# EAGLE design charger (EAGLE 6.4)
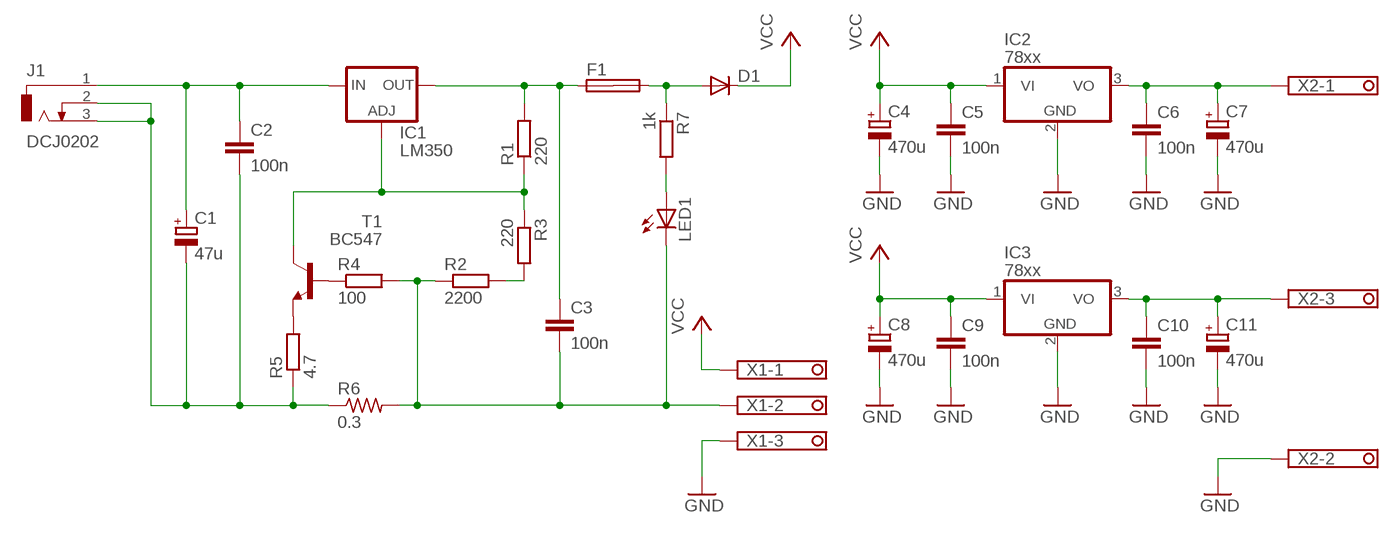
[diagram p0: schematic, sheet 1]

## Parts
C1  47u  CPOL-EUE2.5-7  [E2,5-7]
C2  100n  C-EU050-030X075  [C050-030X075]
C3  100n  C-EU050-030X075  [C050-030X075]
C4  470u  CPOL-EUE5-10.5  [E5-10,5]
C5  100n  C-EU050-030X075  [C050-030X075]
C6  100n  C-EU050-030X075  [C050-030X075]
C7  470u  CPOL-EUE5-10.5  [E5-10,5]
C8  470u  CPOL-EUE5-10.5  [E5-10,5]
C9  100n  C-EU050-030X075  [C050-030X075]
C10  100n  C-EU050-030X075  [C050-030X075]
C11  470u  CPOL-EUE5-10.5  [E5-10,5]
D1  SB320  [DO201-15]
F1  SHK20L  [SHK20L]
IC1  LM350  LM317TS  [317TS]
IC2  78xx  7805TV  [TO220V]
IC3  78xx  7805TV  [TO220V]
J1  DCJ0202  [DCJ0202]
LED1  LED5MM  [LED5MM]
R1  220  R-EU_0207/10  [0207/10]
R2  2200  R-EU_0207/10  [0207/10]
R3  220  R-EU_0207/10  [0207/10]
R4  100  R-EU_0207/10  [0207/10]
R5  4.7  R-EU_0207/10  [0207/10]
R6  0.3  R-US_0617/22  [0617/22]
R7  1k  R-EU_0207/10  [0207/10]
T1  BC547  [TO92]
X1  1751251  [1751251]
X2  1751251  [1751251]

## Nets
GND: C4.- C5.2 C6.2 C7.- C8.- C9.2 C10.2 C11.- IC2.2(GND) IC3.2(GND) X1.3 X2.2
N$1: C1.+ C2.1 IC1.3(IN) J1.1
N$2: C1.- C2.2 J1.2 J1.3 R5.1 R6.1
N$3: R4.1 T1.2(B)
N$4: R2.2 R3.2
N$5: IC1.1(ADJ) R1.1 R3.1 T1.3(C)
N$6: C10.1 C11.+ IC3.3(VO) X2.3
N$7: C3.2 LED1.K(C) R2.1 R4.2 R6.2 X1.2
N$8: R5.2 T1.1(E)
N$9: D1.A F1.2A R7.1
N$10: LED1.A R7.2
N$11: C6.1 C7.+ IC2.3(VO) X2.1
N$12: C3.1 F1.1A IC1.2(OUT) R1.2
VCC: C4.+ C5.1 C8.+ C9.1 D1.C IC2.1(VI) IC3.1(VI) X1.1
Unconnected: F1.1B F1.2B

## Library data of the parts
C1 C4 C7 C8 C11 = rcl:CPOL-EU: POLARIZED CAPACITOR, European symbol
C2 C3 C5 C6 C9 C10 = rcl:C-EU: CAPACITOR, European symbol
D1 = diode:SB320: DIODE barrier rectifier, 3 A (Fairchild)
F1 = fuse:SHK20L: FUSE HOLDER 5 x 20 mm, SH contact, SHH1 Schukat, E1073 Buerklin; OC_FARNELL: unknown; OC_NEWARK: unknown
IC1 = v-reg:LM317TS: VOLTAGE REGULATOR
IC2 IC3 = linear:78*: Positive VOLTAGE REGULATOR Source: http://cache.national.com/ds/LM/LM78L05.pdf http://www.fairchildsemi.com/ds/LM/LM7805.pdf
J1 = con-jack:DCJ0202: DC POWER JACK Source: DCJ0202.pdf; OC_FARNELL: unknown; OC_NEWARK: unknown
LED1 = led:LED: LED OSRAM: - CHIPLED LG R971, LG N971, LY N971, LG Q971, LY Q971, LO R971, LY R971 LH N974, LH R974 LS Q976, LO Q976, LY Q976 LO Q996 - Hyper CHIPLED LW Q18S LB Q993, LB Q99A, LB R99A - SideLED LS A670, LO A670, LY A670, LG A670, LP A670 LB A673, LV A673, LT A673, LW A673 LH A674 LY A675 LS A676, LA A676, LO A676, LY A676, LW A676 LS A679, LY A679, LG A679 - Hyper Micro SIDELED® LS Y876, LA Y876, LO Y876, LY Y876 LT Y87S - SmartLED LW L88C, LW L88S LB L89C, LB L89S, LG L890 LS L89K, LO L89K, LY L89K LS L896, LA L896, LO L896, LY L896 - TOPLED LS T670, LO T670, LY T670, LG T670, LP T670 LSG T670, LSP T670, LSY T670, LOP T670, LYG T670 LG T671, LOG T671, LSG T671 LB T673, LV T673, LT T673, LW T673 LH T674 LS T676, LA T676, LO T676, LY T676, LB T676, LH T676, LSB T676, LW T676 LB T67C, LV T67C, LT T67C, LS T67K, LO T67K, LY T67K, LW E67C LS E67B, LA E67B, LO E67B, LY E67B, LB E67C, LV E67C, LT E67C LW T67C LS T679, LY T679, LG T679 LS T770, LO T770, LY T770, LG T770, LP T770 LB T773, LV T773, LT T773, LW T773 LH T774 LS E675, LA E675, LY E675, LS T675 LS T776, LA T776, LO T776, LY T776, LB T776 LHGB T686 LT T68C, LB T68C - Hyper Mini TOPLED® LB M676 - Mini TOPLED Santana® LG M470 LS M47K, LO M47K, LY M47K Source: http://www.osram.convergy.de LUXEON: - LUMILED® LXK2-PW12-R00, LXK2-PW12-S00, LXK2-PW14-U00, LXK2-PW14-V00 LXK2-PM12-R00, LXK2-PM12-S00, LXK2-PM14-U00 LXK2-PE12-Q00, LXK2-PE12-R00, LXK2-PE12-S00, LXK2-PE14-T00, LXK2-PE14-U00 LXK2-PB12-K00, LXK2-PB12-L00, LXK2-PB12-M00, LXK2-PB14-N00, LXK2-PB14-P00, LXK2-PB14-Q00 LXK2-PR12-L00, LXK2-PR12-M00, LXK2-PR14-Q00, LXK2-PR14-R00 LXK2-PD12-Q00, LXK2-PD12-R00, LXK2-PD12-S00 LXK2-PH12-R00, LXK2-PH12-S00 LXK2-PL12-P00, LXK2-PL12-Q00, LXK2-PL12-R00 Source: www.luxeon.com KINGBRIGHT: KA-3528ASYC Source: www.kingbright.com
R1-R5 R7 = rcl:R-EU_: RESISTOR, European symbol
R6 = rcl:R-US_: RESISTOR, American symbol
T1 = transistor:BC547: NPN TRANSISTOR
X1 X2 = con-phoenix-350:1751251: MKDS 1/ 3-3,5 Printklemme Nennstrom: 10 A Bemessungsspannung: 160 V Raster: 3,5 mm Polzahl: 3 Montageart: Löten Anschlussart: Schraubanschluss Anschlussrichtung vom Leiter zur Platine: 0° Source: http://eshop.phoenixcontact.com .. 1751251.pdf; OC_FARNELL: unknown; OC_NEWARK: unknown

## Board
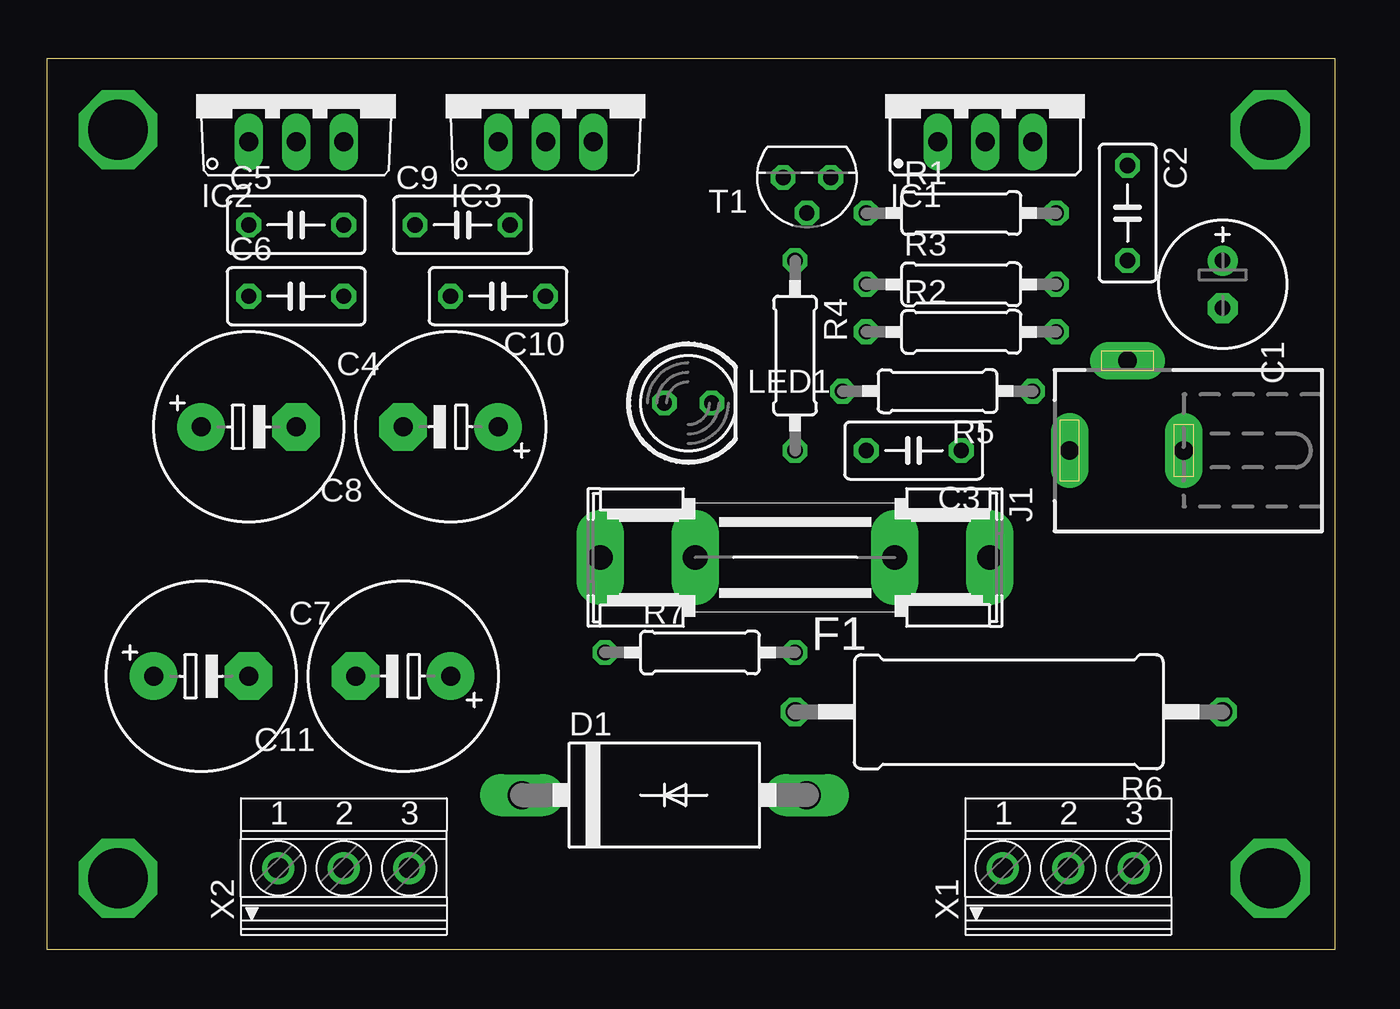
[diagram p1: board, top side]
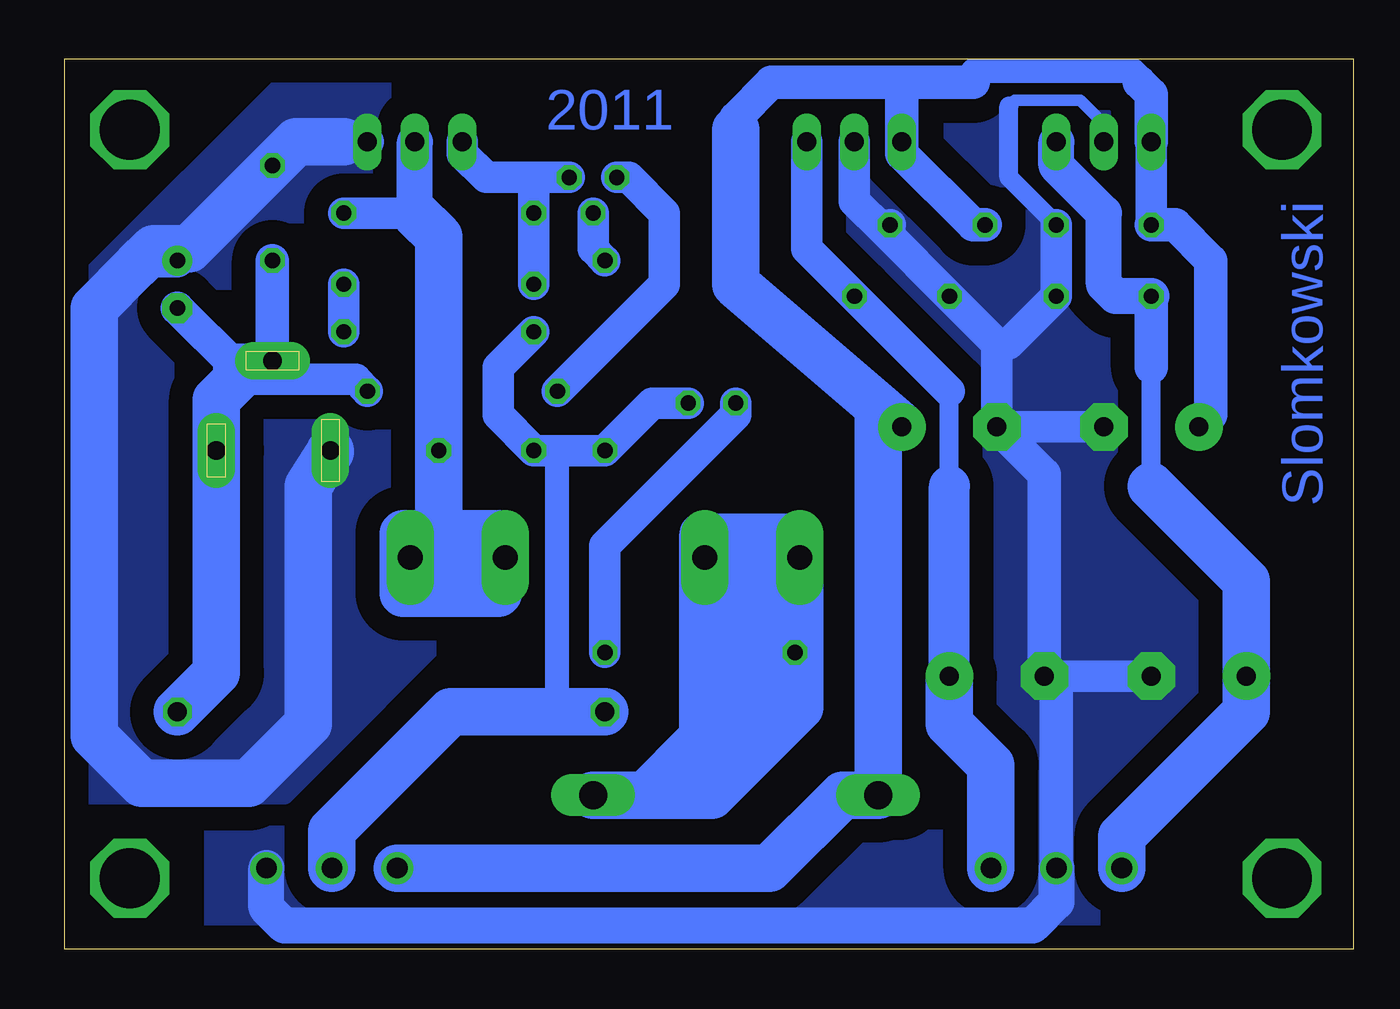
[diagram p2: board, bottom side, seen from below]

Size 68.89 x 47.62 mm. Coordinates in mm from the lower left corner, seen from the top.
Outline: 0,0 68.89,0 68.89,47.62 0,47.62 0,0
Copper layers (1*16): Top 0.035mm / dielectric 1.5mm / Bottom 0.035mm
Design rules "default": minimum track width 10mil, minimum drill 24mil, track to track 8mil, track to pad 8mil, pad to pad 8mil, via to via 8mil, smd to smd 8mil, copper to edge 40mil, drill to drill 8mil, minimum pad ring 10mil, minimum via ring 8mil, stop-mask expansion 4mil, vias tented up to drill 0mil, thermal gap 10mil

### Footprints (pad centres in the part's own frame; a part is rotated, then mirrored left to right if it is on the bottom)
E2,5-7 = drill 0.813 pad 1.6: + -1.27,0 | drill 0.813 pad 1.6 octagon: - 1.27,0
C050-030X075 = drill 0.813 octagon: 1 -2.54,0; 2 2.54,0
E5-10,5 = drill 1.016 pad 2.54: + -2.54,0 | drill 1.016 pad 2.54 octagon: - 2.54,0
DO201-15 = drill 1.499 long: A 7.62,0; C -7.62,0
SHK20L = drill 1.321 pad 2.54 long: 1A -10.414,0; 1B -5.334,0; 2A 10.414,0; 2B 5.334,0
317TS = drill 1.016 long: 1 -2.54,-2.54; 2 0,-2.54; 3 2.54,-2.54
TO220V = drill 1.016 long: 1 -2.54,-2.54; 2 0,-2.54; 3 2.54,-2.54
DCJ0202 = drill 1 pad 2 long: 1 0,3.1; 2 4.8,0; 3 0,-3
LED5MM = drill 0.813 octagon: A -1.27,0; K 1.27,0
0207/10 = drill 0.813 octagon: 1 -5.08,0; 2 5.08,0
0617/22 = drill 1.016 octagon: 1 -11.43,0; 2 11.43,0
TO92 = drill 0.813 octagon: 1 1.27,0; 2 0,1.905; 3 -1.27,0
1751251 = drill 1.1 pad 1.7: 1 -3.5,-0.1; 2 0,-0.1; 3 3.5,-0.1

### Placement (x,y rotation side)
C1  62.87,35.56 270 top
C2  57.79,39.37 270 top
C3  46.36,26.67 180 top
C4  10.8,27.94 0 top
C5  13.34,38.73 0 top
C6  13.34,34.92 0 top
C7  8.25,14.61 0 top
C8  21.59,27.94 180 top
C9  22.22,38.73 0 top
C10  24.13,34.92 180 top
C11  19.05,14.61 180 top
D1  33.02,8.26 0 top
F1  40.01,20.95 180 top
IC1  50.17,45.72 0 top
IC2  13.34,45.72 0 top
IC3  26.67,45.72 0 top
J1  57.79,26.67 90 top
LED1  34.29,29.21 0 top
R1  48.9,39.37 0 top
R2  48.9,33.02 0 top
R3  48.9,35.56 0 top
R4  40.01,31.75 270 top
R5  47.62,29.84 180 top
R6  51.44,12.7 180 top
R7  34.93,15.88 0 top
T1  40.64,41.27 180 top
X1  54.61,4.45 0 top
X2  15.88,4.45 0 top

### Tracks (layer width: path | path; a pad name or v marks a point on that pad's centre or on a via)
GND
  Bottom 0.61: IC2.2 13.34,44.13 14.61,45.4 18.1,45.4 18.41,45.09
  Bottom 1.016: 18.41,45.09 18.41,41.27 C5.2
  Bottom 1.676: 25.08,38.42 C10.2 19.05,32.38 | 25.08,38.42 26.67,40.01 IC3.2 | 25.08,38.42 C9.2 | 19.05,32.38 C8.- C4.- | C5.2 C6.2 18.41,32.38 19.05,32.38 | C11.- C7.-
  Bottom 1.778: X2.2 15.88,13.97 C11.- 16.51,25.4 C8.-
  Bottom 1.93: X1.3 58.11,2.23 57.15,1.27 17.14,1.27 15.88,2.54 X2.2
  pour Bottom (isolate 1.27, no thermals): 7.62,46.99 42.55,46.99 42.55,13.34 46.99,8.89 60.96,8.89 60.96,0.64 8.25,0.64 7.62,1.27
N$1
  Bottom 1.778: 53.98,43.18 IC1.3 | C1.+ 64.77,36.83 65.09,36.51
  Bottom 2.54: J1.1 54.69,26.59 55.88,24.77 55.88,12.06 59.05,8.89 64.77,8.89 67.31,11.43 67.31,34.29 65.09,36.51 64.14,37.47 62.23,37.47 C2.1 56.52,43.18 53.98,43.18
  pour Bottom (isolate 1.27, no thermals): 46.99,46.99 46.99,18.41 57.15,8.26 67.95,8.26 67.95,35.56 56.52,46.99
N$2
  Bottom 1.676: R5.1 53.34,30.48 59.69,30.48 59.37,30.8
  Bottom 1.778: J1.2 C2.2 | 59.69,31.11 C1.-
  Bottom 2.54: R6.1 60.79,14.78 J1.3 60.79,29.39 59.37,30.8 59.69,31.11 58.14,31.11 J1.2
N$3
  Bottom 1.676: T1.2 40.64,37.47 R4.1
N$4
  Bottom 1.676: R2.2 R3.2
N$5
  Bottom 1.676: 43.82,41.27 T1.3 | 43.82,41.27 46.36,41.27 47.62,42.55 IC1.1 | R3.1 R1.1 43.82,41.27
N$6
  Bottom 1.016: 21.59,24.77 21.59,29.84
  Bottom 1.676: 21.59,29.84 C10.1 29.21,37.47 IC3.3
  Bottom 2.184: C11.+ 21.59,24.77
  Bottom 2.54: X2.3 19.38,9.85 21.59,12.06 C11.+
N$7
  Bottom 1.27: 42.55,12.7 42.55,26.67
  Bottom 1.676: R2.1 45.72,31.11 45.72,28.57 C3.2 42.55,26.67 R4.2 37.47,29.21 LED1.K
  Bottom 2.54: X1.2 54.61,6.35 48.26,12.7 42.55,12.7 R6.2
N$8
  Bottom 1.676: T1.1 38.73,41.27 36.83,39.37 36.83,35.56 R5.2
N$9
  Bottom 1.676: R7.1 29.85,14.86 29.59,14.61
  Bottom 2.184: 38.1,8.26 34.93,11.43 34.93,22.23 29.85,22.23
  Bottom 2.54: D1.A 38.1,8.26 34.29,8.26 29.59,12.95 29.59,14.61 F1.2A
N$10
  Bottom 1.676: R7.2 40.01,21.59 33.02,28.57 LED1.A
N$11
  Bottom 1.016: 10.8,24.77 10.8,31.11
  Bottom 1.778: 10.8,31.11 C6.1
  Bottom 1.93: IC2.3 15.88,41.91 13.34,39.37 13.34,35.56 12.7,34.92 C6.1
  Bottom 2.54: X2.1 12.38,6.04 5.72,12.7 C7.+ 5.72,19.68 10.8,24.77
N$12
  Bottom 1.676: 50.17,39.37 R1.2
  Bottom 1.93: 50.17,39.37 IC1.2
  Bottom 2.54: 50.17,39.37 48.9,38.1 C3.1 48.9,25.4 48.9,21.59 F1.1A
N$13  (via drill 3.2)
  other vias: 3.81,3.81
N$14  (via drill 3.2)
  other vias: 65.41,3.81
N$15  (via drill 3.2)
  other vias: 3.81,43.81
N$16  (via drill 3.2)
  other vias: 65.41,43.81
N$17
  Bottom 3.81: 32.39,20.95 32.39,12.06 34.29,10.16
N$18
  Bottom 2.54: 45.72,22.23 50.8,22.23 50.8,19.05 45.72,19.05 45.72,22.23
N$19
  Bottom 2.54: 46.99,20.32 48.9,20.32
VCC
  Bottom 1.27: 11.43,46.35 11.43,46.67 11.75,46.99 20.32,46.99 20.32,46.35
  Bottom 1.676: IC2.1 C5.1
  Bottom 1.778: 33.02,43.81 33.02,44.45 31.11,46.35 24.13,46.35 | 11.43,46.35 10.8,45.72 IC2.1 | 24.13,46.35 IC3.1 24.13,42.55 20.32,38.73 C9.1 | 24.13,46.35 20.32,46.35 | C5.1 9.52,38.73 7.62,36.83 7.62,28.57 C4.+
  Bottom 2.54: X1.1 31.21,4.34 27.3,8.26 D1.C 25.4,29.01 25.54,29.15 | 25.54,29.15 C8.+ | 25.54,29.15 33.02,35.56 33.02,43.81

### Text on the board
Bottom: 2011 | Slomkowski